# EAGLE schematic flight-computer v6 (EAGLE 9.7.0)

## Sheet 1 of 4
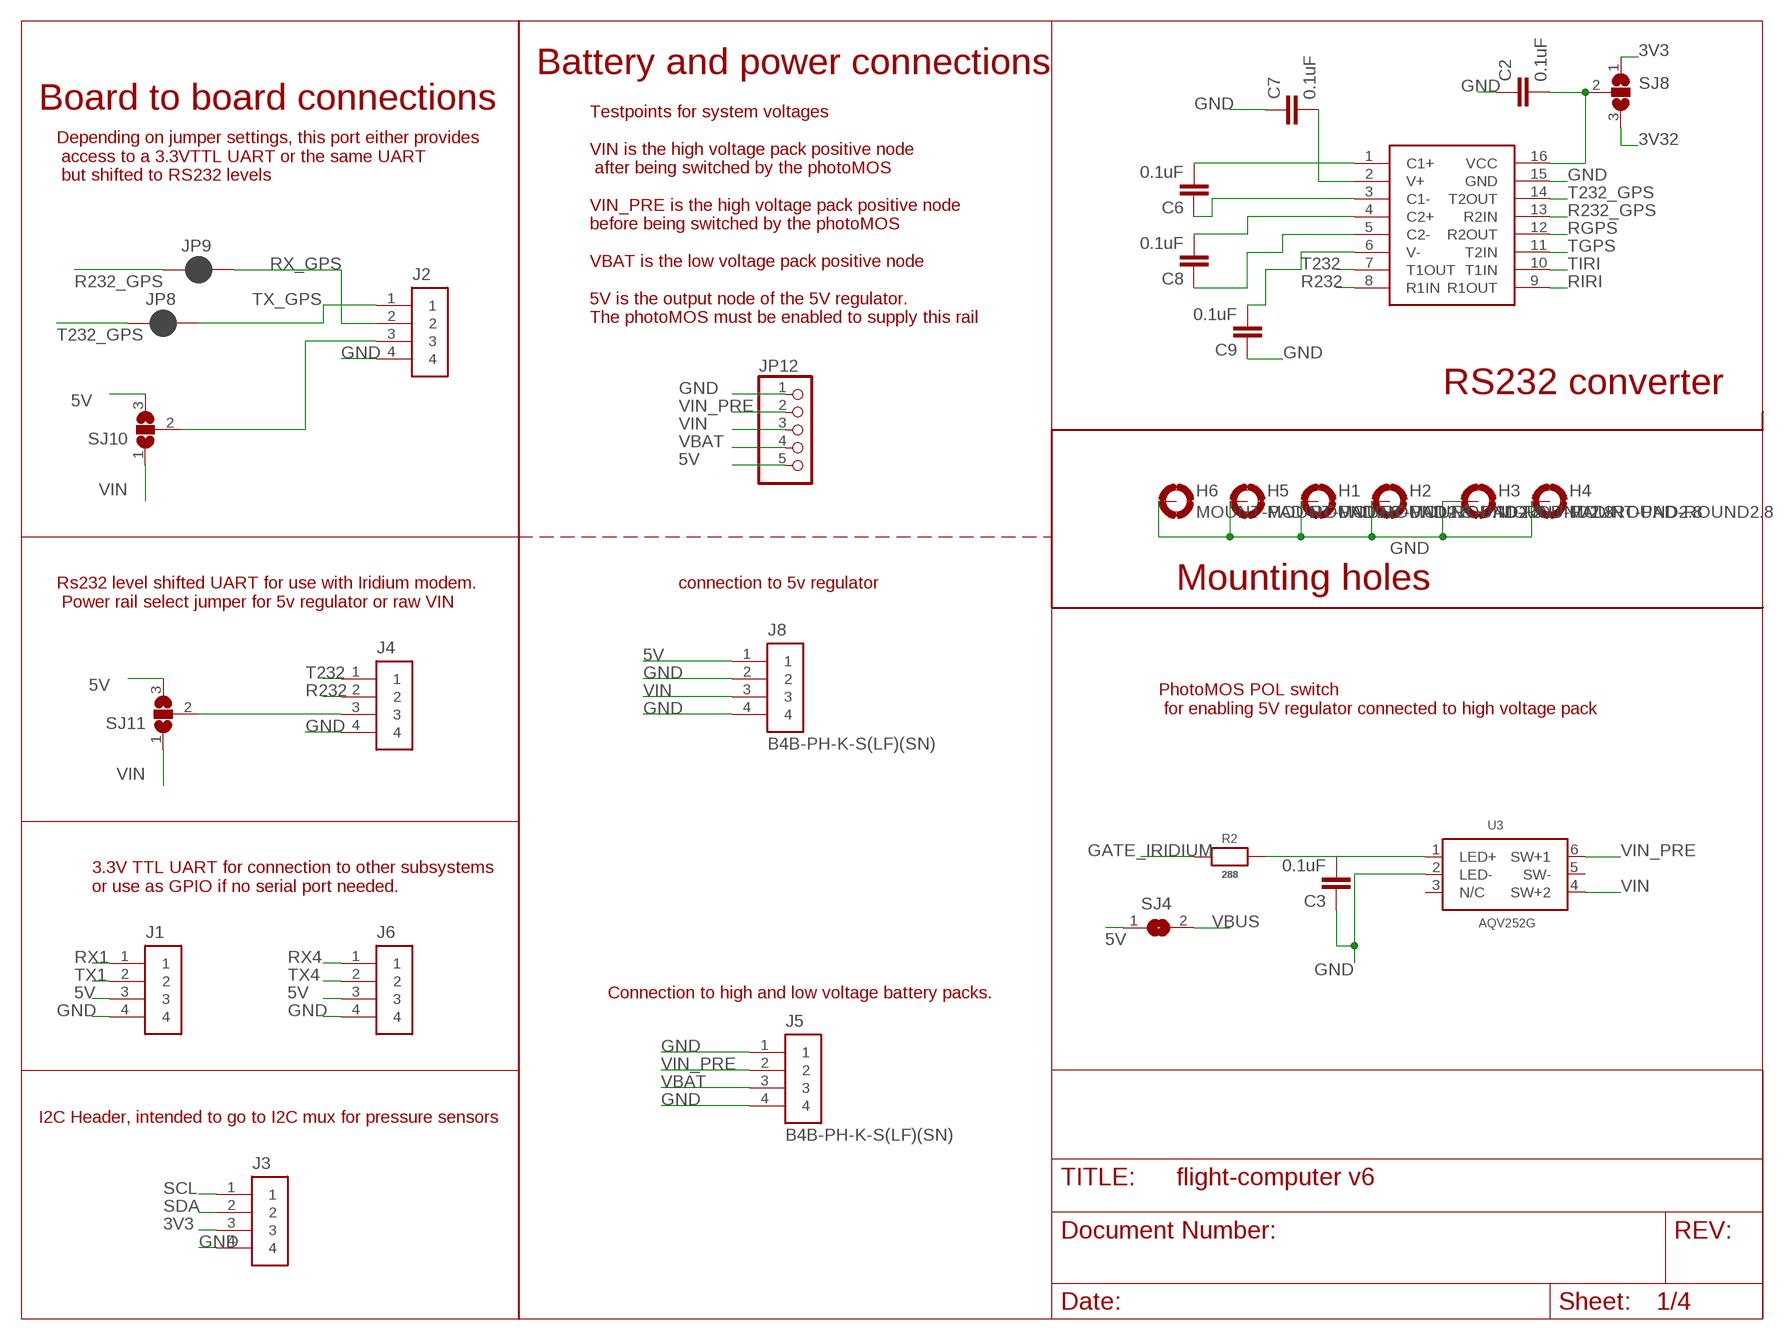
[diagram p0: schematic, sheet 1]

### Parts
C2  0.1uF  C-EUC0603  [C0603]
C3  0.1uF  C-EUC0603  [C0603]
C6  0.1uF  C-EUC0603  [C0603]
C7  0.1uF  C-EUC0603  [C0603]
C8  0.1uF  C-EUC0603  [C0603]
C9  0.1uF  C-EUC0603  [C0603]
H1  MOUNT-PAD-ROUND2.8  [2,8-PAD]
H2  MOUNT-PAD-ROUND2.8  [2,8-PAD]
H3  MOUNT-PAD-ROUND2.8  [2,8-PAD]
H4  MOUNT-PAD-ROUND2.8  [2,8-PAD]
H5  MOUNT-PAD-ROUND2.8  [2,8-PAD]
H6  MOUNT-PAD-ROUND2.8  [2,8-PAD]
J1  B4B-PH-K-S(LF)(SN)  [JST_B4B-PH-K-S(LF)(SN)]
J2  B4B-PH-K-S(LF)(SN)  [JST_B4B-PH-K-S(LF)(SN)]
J3  B4B-PH-K-S(LF)(SN)  [JST_B4B-PH-K-S(LF)(SN)]
J4  B4B-PH-K-S(LF)(SN)  [JST_B4B-PH-K-S(LF)(SN)]
J5  B4B-PH-K-S(LF)(SN)  [JST_B4B-PH-K-S(LF)(SN)]
J6  B4B-PH-K-S(LF)(SN)  [JST_B4B-PH-K-S(LF)(SN)]
J8  B4B-PH-K-S(LF)(SN)  [JST_B4B-PH-K-S(LF)(SN)]
JP8  JUMPER-SMT_2_NC_PASTE_SILK  [SMT-JUMPER_2_NC_PASTE_SILK]
JP9  JUMPER-SMT_2_NC_PASTE_SILK  [SMT-JUMPER_2_NC_PASTE_SILK]
JP12  PINHD-1X55X2MM  [1_05X2MM]
R2  288  RESISTOR_0603_NOOUT  [0603-NO]
SJ4  SJ  [SJ]
SJ8  SJ2W  [SJ_2]
SJ10  SJ2W  [SJ_2]
SJ11  SJ2W  [SJ_2]
U3  AQV252G  [SOP6]
U11  UM3232EEAE  [RQ_16_ADI]

### Nets
3V3: J3.3 SJ8.1 ; also sheet 2,3,4
3V32: SJ8.3 ; also sheet 2
5V: J1.3 J6.3 J8.1 JP12.5 SJ4.1 SJ10.3 SJ11.3 ; also sheet 2
GATE_IRIDIUM: R2.1 ; also sheet 2,4
GND [gnd]: C2.1 C3.1 C7.1 C9.1 H1.B2,8(MOUNT) H2.B2,8(MOUNT) H3.B2,8(MOUNT) H4.B2,8(MOUNT) H5.B2,8(MOUNT) H6.B2,8(MOUNT) J1.4 J2.4 J3.4 J4.4 J5.1 J5.4 J6.4 J8.2 J8.4 JP12.1 U3.2(LED-) U11.15(GND) ; also sheet 2,3,4
N$5: C6.2 U11.1(C1+)
N$6: J2.3 SJ10.2
N$9: C2.2 SJ8.2 U11.16(VCC)
N$11: C7.2 U11.2(V+)
N$12: C6.1 U11.3(C1-)
N$13: C8.2 U11.4(C2+)
N$14: C8.1 U11.5(C2-)
N$15: C9.2 U11.6(V-)
N$16: J4.3 SJ11.2
N$18: C3.2 R2.2 U3.1(LED+)
R232: J4.2 U11.8(R1IN)
R232_GPS: JP9.1 U11.13(R2IN)
RGPS: U11.12(R2OUT) ; also sheet 2
RIRI: U11.9(R1OUT) ; also sheet 2
RX1: J1.1 ; also sheet 2
RX4: J6.1 ; also sheet 2
RX_GPS: J2.2 JP9.2 ; also sheet 2
SCL: J3.1 ; also sheet 2,3,4
SDA: J3.2 ; also sheet 2,3,4
T232: J4.1 U11.7(T1OUT)
T232_GPS: JP8.1 U11.14(T2OUT)
TGPS: U11.11(T2IN) ; also sheet 2
TIRI: U11.10(T1IN) ; also sheet 2
TX1: J1.2 ; also sheet 2
TX4: J6.2 ; also sheet 2
TX_GPS: J2.1 JP8.2 ; also sheet 2
VBAT: J5.3 JP12.4 ; also sheet 2
VBUS: SJ4.2 ; also sheet 2
VIN: J8.3 JP12.3 SJ10.1 SJ11.1 U3.4(SW+2)
VIN_PRE: J5.2 JP12.2 U3.6(SW+1)
Unconnected: U3.3(N/C) U3.5(SW-)

### Notes on the sheet
- Battery and power connections
- Board to board connections
- Depending on jumper settings, this port either provides
   access to a 3.3VTTL UART or the same UART
   but shifted to RS232 levels
- Testpoints for system voltages
  
  VIN is the high voltage pack positive node
   after being switched by the photoMOS
  
  VIN_PRE is the high voltage pack positive node
  before being switched by the photoMOS
  
  VBAT is the low voltage pack positive node
  
  5V is the output node of the 5V regulator. 
  The photoMOS must be enabled to supply this rail
- RS232 converter
- Mounting holes
- Rs232 level shifted UART for use with Iridium modem.
   Power rail select jumper for 5v regulator or raw VIN
- connection to 5v regulator
- PhotoMOS POL switch
   for enabling 5V regulator connected to high voltage pack
- 3.3V TTL UART for connection to other subsystems
  or use as GPIO if no serial port needed.
- Connection to high and low voltage battery packs.
- I2C Header, intended to go to I2C mux for pressure sensors

## Sheet 2 of 4
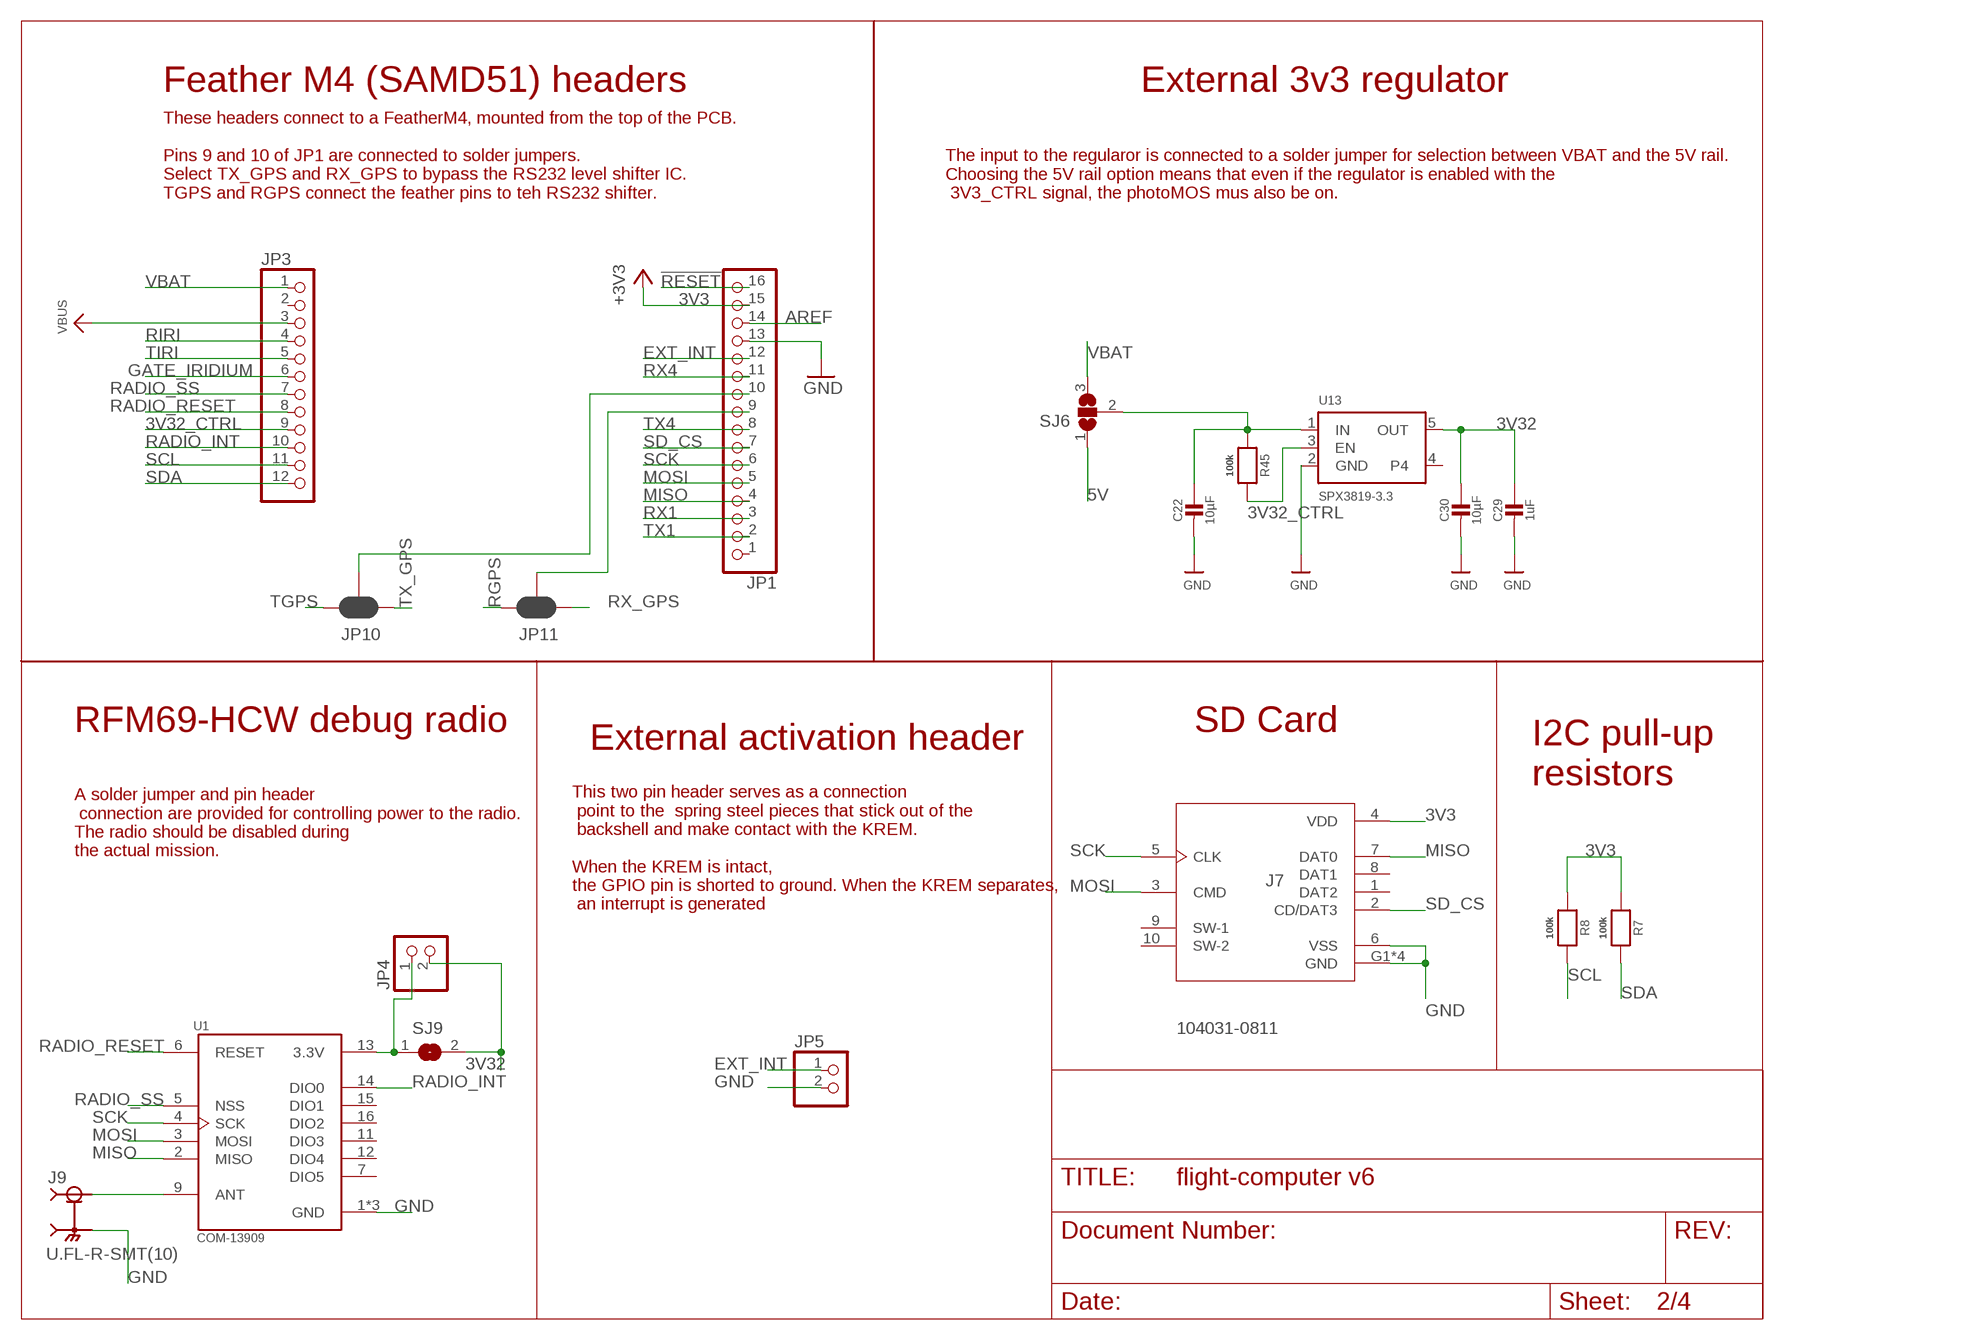
[diagram p1: schematic, sheet 2]

### Parts
C22  10µF  CAP_CERAMIC0805-NOOUTLINE  [0805-NO]
C29  1uF  CAP_CERAMIC0603_NO  [0603-NO]
C30  10µF  CAP_CERAMIC0805-NOOUTLINE  [0805-NO]
J7  104031-0811  [MOLEX_104031-0811]
J9  U.FL-R-SMT(10)  [HRS_U.FL-R-SMT(10)]
JP1  HEADER-1X16ROUND  [1X16_ROUND]
JP3  HEADER-1X12  [1X12_ROUND]
JP4  PINHD-1X2  [1X02]
JP5  PINHD-1X2  [1X02]
JP10  JUMPER-SMT_3_2-NC_PASTE_NO-SILK  [SMT-JUMPER_3_2-NC_PASTE_NO-SILK]
JP11  JUMPER-SMT_3_2-NC_PASTE_NO-SILK  [SMT-JUMPER_3_2-NC_PASTE_NO-SILK]
R7  100k  RESISTOR_0603_NOOUT  [0603-NO]
R8  100k  RESISTOR_0603_NOOUT  [0603-NO]
R45  100k  RESISTOR_0603_NOOUT  [0603-NO]
SJ6  SJ2W  [SJ_2]
SJ9  SJ  [SJ]
U1  COM-13909  [MOD_COM-13909]
U13  SPX3819-3.3  VREG_SOT23-5  [SOT23-5]

### Nets
3V3: J7.4(VDD) JP1.15 R7.1 R8.1 ; supply symbol labelled +3V3 ; also sheet 1,3,4
3V32: C29.1 C30.1 JP4.2 SJ9.2 U13.5(OUT) ; also sheet 1
3V32_CTRL: JP3.9 R45.2 U13.3(EN) ; also sheet 4
5V: SJ6.1 ; also sheet 1
!RESET: JP1.16
AREF: JP1.14
EXT_INT: JP1.12 JP5.1
GATE_IRIDIUM: JP3.6 ; also sheet 1,4
GND [gnd]: C22.2 C29.2 C30.2 J7.6(VSS) J7.G1(GND) J7.G2(GND) J7.G3(GND) J7.G4(GND) J9.2(GND) J9.3(GND) JP1.13 JP5.2 U1.1(GND) U1.8(GND) U1.10(GND) U13.2(GND) ; also sheet 1,3,4
MISO: J7.7(DAT0) JP1.4 U1.2(MISO)
MOSI: J7.3(CMD) JP1.5 U1.3(MOSI)
N$1: JP4.1 SJ9.1 U1.13(3.3V)
N$30: C22.1 R45.1 SJ6.2 U13.1(IN)
N$31: J9.1(SIG) U1.9(ANT)
N$38: JP1.10 JP10.2
N$39: JP1.9 JP11.2
RADIO_INT: JP3.10 U1.14(DIO0)
RADIO_RESET: JP3.8 U1.6(RESET)
RADIO_SS: JP3.7 U1.5(NSS)
RGPS: JP11.3 ; also sheet 1
RIRI: JP3.4 ; also sheet 1
RX1: JP1.3 ; also sheet 1
RX4: JP1.11 ; also sheet 1
RX_GPS: JP11.1 ; also sheet 1
SCK: J7.5(CLK) JP1.6 U1.4(SCK)
SCL: JP3.11 R8.2 ; also sheet 1,3,4
SD_CS: J7.2(CD/DAT3) JP1.7
SDA: JP3.12 R7.2 ; also sheet 1,3,4
TGPS: JP10.3 ; also sheet 1
TIRI: JP3.5 ; also sheet 1
TX1: JP1.2 ; also sheet 1
TX4: JP1.8 ; also sheet 1
TX_GPS: JP10.1 ; also sheet 1
VBAT: JP3.1 SJ6.3 ; also sheet 1
VBUS: JP3.3 ; also sheet 1
Unconnected: J7.1(DAT2) J7.8(DAT1) J7.9(SW-1) J7.10(SW-2) JP1.1 JP3.2 U1.7(DIO5) U1.11(DIO3) U1.12(DIO4) U1.15(DIO1) U1.16(DIO2) U13.4

### Notes on the sheet
- Feather M4 (SAMD51) headers | External 3v3 regulator
- These headers connect to a FeatherM4, mounted from the top of the PCB.
  
  Pins 9 and 10 of JP1 are connected to solder jumpers. 
  Select TX_GPS and RX_GPS to bypass the RS232 level shifter IC.
  TGPS and RGPS connect the feather pins to teh RS232 shifter.
- The input to the regularor is connected to a solder jumper for selection between VBAT and the 5V rail. 
  Choosing the 5V rail option means that even if the regulator is enabled with the
   3V3_CTRL signal, the photoMOS mus also be on.
- RFM69-HCW debug radio | SD Card
- External activation header
- I2C pull-up 
  resistors
- A solder jumper and pin header
   connection are provided for controlling power to the radio.
  The radio should be disabled during 
  the actual mission.
- This two pin header serves as a connection
   point to the  spring steel pieces that stick out of the
   backshell and make contact with the KREM.
  
  When the KREM is intact, 
  the GPIO pin is shorted to ground. When the KREM separates,
   an interrupt is generated

## Sheet 3 of 4
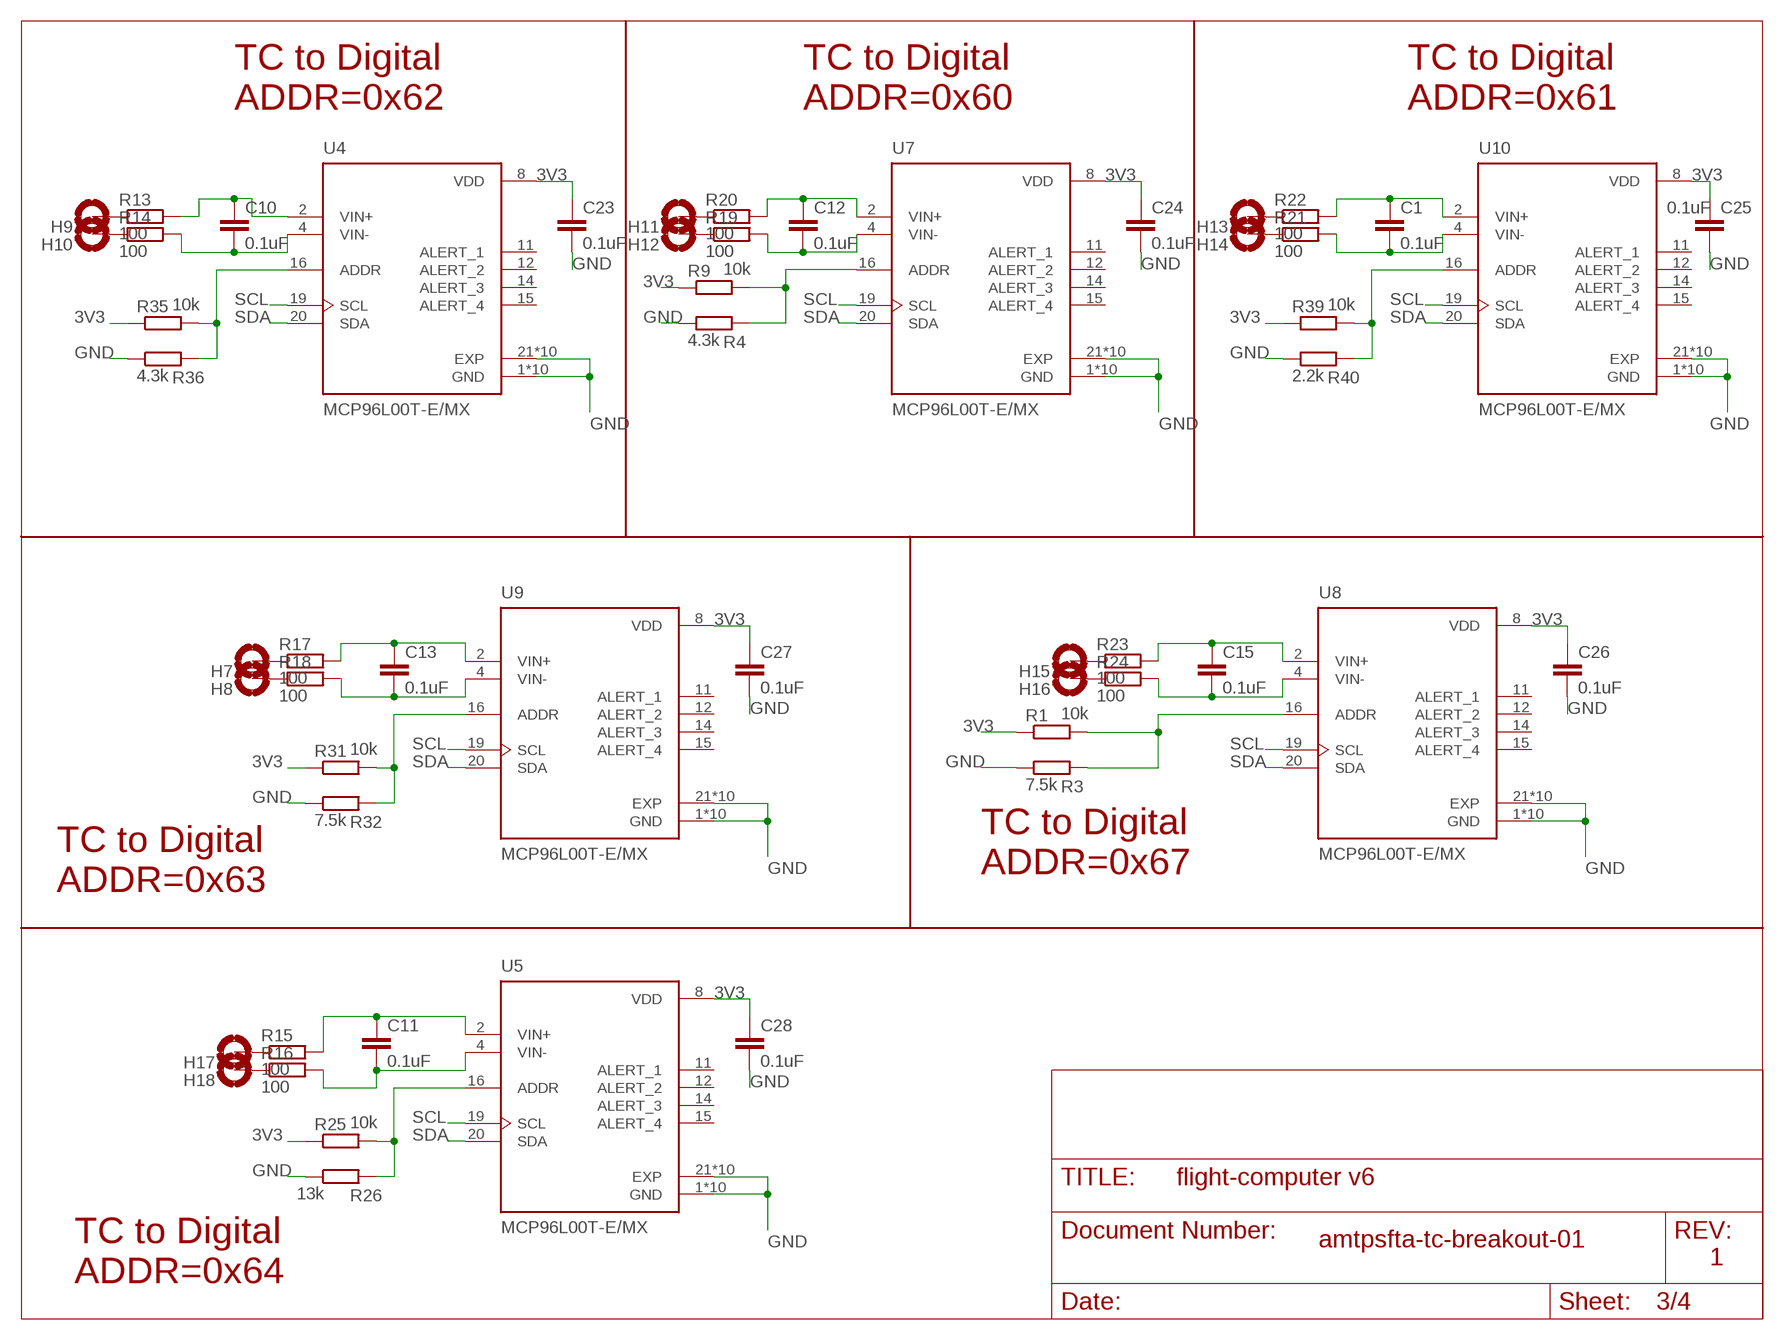
[diagram p2: schematic, sheet 3]

### Parts
C1  0.1uF  C-EUC0603  [C0603]
C10  0.1uF  C-EUC0603  [C0603]
C11  0.1uF  C-EUC0603  [C0603]
C12  0.1uF  C-EUC0603  [C0603]
C13  0.1uF  C-EUC0603  [C0603]
C15  0.1uF  C-EUC0603  [C0603]
C23  0.1uF  C-EUC0603  [C0603]
C24  0.1uF  C-EUC0603  [C0603]
C25  0.1uF  C-EUC0603  [C0603]
C26  0.1uF  C-EUC0603  [C0603]
C27  0.1uF  C-EUC0603  [C0603]
C28  0.1uF  C-EUC0603  [C0603]
H7  MOUNT-PAD-ROUND2.8  [2,8-PAD]
H8  MOUNT-PAD-ROUND2.8  [2,8-PAD]
H9  MOUNT-PAD-ROUND2.8  [2,8-PAD]
H10  MOUNT-PAD-ROUND2.8  [2,8-PAD]
H11  MOUNT-PAD-ROUND2.8  [2,8-PAD]
H12  MOUNT-PAD-ROUND2.8  [2,8-PAD]
H13  MOUNT-PAD-ROUND2.8  [2,8-PAD]
H14  MOUNT-PAD-ROUND2.8  [2,8-PAD]
H15  MOUNT-PAD-ROUND2.8  [2,8-PAD]
H16  MOUNT-PAD-ROUND2.8  [2,8-PAD]
H17  MOUNT-PAD-ROUND2.8  [2,8-PAD]
H18  MOUNT-PAD-ROUND2.8  [2,8-PAD]
R1  10k  R-EU_R0603  [R0603]
R3  7.5k  R-EU_R0603  [R0603]
R4  4.3k  R-EU_R0603  [R0603]
R9  10k  R-EU_R0603  [R0603]
R13  100  R-EU_R0603  [R0603]
R14  100  R-EU_R0603  [R0603]
R15  100  R-EU_R0603  [R0603]
R16  100  R-EU_R0603  [R0603]
R17  100  R-EU_R0603  [R0603]
R18  100  R-EU_R0603  [R0603]
R19  100  R-EU_R0603  [R0603]
R20  100  R-EU_R0603  [R0603]
R21  100  R-EU_R0603  [R0603]
R22  100  R-EU_R0603  [R0603]
R23  100  R-EU_R0603  [R0603]
R24  100  R-EU_R0603  [R0603]
R25  10k  R-EU_R0603  [R0603]
R26  13k  R-EU_R0603  [R0603]
R31  10k  R-EU_R0603  [R0603]
R32  7.5k  R-EU_R0603  [R0603]
R35  10k  R-EU_R0603  [R0603]
R36  4.3k  R-EU_R0603  [R0603]
R39  10k  R-EU_R0603  [R0603]
R40  2.2k  R-EU_R0603  [R0603]
U4  MCP96L00T-E/MX  [QFN65P500X500X100-21N_MCP96L00T-E/MX]
U5  MCP96L00T-E/MX  [QFN65P500X500X100-21N_MCP96L00T-E/MX]
U7  MCP96L00T-E/MX  [QFN65P500X500X100-21N_MCP96L00T-E/MX]
U8  MCP96L00T-E/MX  [QFN65P500X500X100-21N_MCP96L00T-E/MX]
U9  MCP96L00T-E/MX  [QFN65P500X500X100-21N_MCP96L00T-E/MX]
U10  MCP96L00T-E/MX  [QFN65P500X500X100-21N_MCP96L00T-E/MX]

### Nets
3V3: C23.1 C24.1 C25.1 C26.1 C27.1 C28.1 R1.1 R9.1 R25.1 R31.1 R35.1 R39.1 U4.8(VDD) U5.8(VDD) U7.8(VDD) U8.8(VDD) U9.8(VDD) U10.8(VDD) ; also sheet 1,2,4
GND [gnd]: C23.2 C24.2 C25.2 C26.2 C27.2 C28.2 R3.1 R4.1 R26.1 R32.1 R36.1 R40.1 U4.1(GND) U4.3(GND) U4.5(GND) U4.6(GND) U4.7(GND) U4.9(GND) U4.10(GND) U4.13(GND) U4.17(GND) U4.18(GND) U4.21(EXP) U4.22(EXP) U4.23(EXP) U4.24(EXP) U4.25(EXP) U4.26(EXP) U4.27(EXP) U4.28(EXP) U4.29(EXP) U4.30(EXP) U5.1(GND) U5.3(GND) U5.5(GND) U5.6(GND) U5.7(GND) U5.9(GND) U5.10(GND) U5.13(GND) U5.17(GND) U5.18(GND) U5.21(EXP) U5.22(EXP) U5.23(EXP) U5.24(EXP) U5.25(EXP) U5.26(EXP) U5.27(EXP) U5.28(EXP) U5.29(EXP) U5.30(EXP) U7.1(GND) U7.3(GND) U7.5(GND) U7.6(GND) U7.7(GND) U7.9(GND) U7.10(GND) U7.13(GND) U7.17(GND) U7.18(GND) U7.21(EXP) U7.22(EXP) U7.23(EXP) U7.24(EXP) U7.25(EXP) U7.26(EXP) U7.27(EXP) U7.28(EXP) U7.29(EXP) U7.30(EXP) U8.1(GND) U8.3(GND) U8.5(GND) U8.6(GND) U8.7(GND) U8.9(GND) U8.10(GND) U8.13(GND) U8.17(GND) U8.18(GND) U8.21(EXP) U8.22(EXP) U8.23(EXP) U8.24(EXP) U8.25(EXP) U8.26(EXP) U8.27(EXP) U8.28(EXP) U8.29(EXP) U8.30(EXP) U9.1(GND) U9.3(GND) U9.5(GND) U9.6(GND) U9.7(GND) U9.9(GND) U9.10(GND) U9.13(GND) U9.17(GND) U9.18(GND) U9.21(EXP) U9.22(EXP) U9.23(EXP) U9.24(EXP) U9.25(EXP) U9.26(EXP) U9.27(EXP) U9.28(EXP) U9.29(EXP) U9.30(EXP) U10.1(GND) U10.3(GND) U10.5(GND) U10.6(GND) U10.7(GND) U10.9(GND) U10.10(GND) U10.13(GND) U10.17(GND) U10.18(GND) U10.21(EXP) U10.22(EXP) U10.23(EXP) U10.24(EXP) U10.25(EXP) U10.26(EXP) U10.27(EXP) U10.28(EXP) U10.29(EXP) U10.30(EXP) ; also sheet 1,2,4
N$2: H7.B2,8(MOUNT) R17.1
N$8: H8.B2,8(MOUNT) R18.1
N$10: R1.2 R3.2 U8.16(ADDR)
N$17: R4.2 R9.2 U7.16(ADDR)
N$20: H9.B2,8(MOUNT) R13.1
N$21: H10.B2,8(MOUNT) R14.1
N$22: H11.B2,8(MOUNT) R20.1
N$23: H12.B2,8(MOUNT) R19.1
N$24: H13.B2,8(MOUNT) R22.1
N$25: H14.B2,8(MOUNT) R21.1
N$26: H15.B2,8(MOUNT) R23.1
N$27: H16.B2,8(MOUNT) R24.1
N$28: H17.B2,8(MOUNT) R15.1
N$29: H18.B2,8(MOUNT) R16.1
N$32: C10.1 R13.2 U4.2(VIN+)
N$34: C10.2 R14.2 U4.4(VIN-)
N$45: C12.1 R20.2 U7.2(VIN+)
N$46: C12.2 R19.2 U7.4(VIN-)
N$47: C15.1 R23.2 U8.2(VIN+)
N$48: C1.2 R21.2 U10.4(VIN-)
N$49: C15.2 R24.2 U8.4(VIN-)
N$50: C1.1 R22.2 U10.2(VIN+)
N$51: C13.1 R17.2 U9.2(VIN+)
N$53: C13.2 R18.2 U9.4(VIN-)
N$54: C11.1 R15.2 U5.2(VIN+)
N$55: C11.2 R16.2 U5.4(VIN-)
N$57: R25.2 R26.2 U5.16(ADDR)
N$58: R31.2 R32.2 U9.16(ADDR)
N$60: R35.2 R36.2 U4.16(ADDR)
N$62: R39.2 R40.2 U10.16(ADDR)
SCL: U4.19(SCL) U5.19(SCL) U7.19(SCL) U8.19(SCL) U9.19(SCL) U10.19(SCL) ; also sheet 1,2,4
SDA: U4.20(SDA) U5.20(SDA) U7.20(SDA) U8.20(SDA) U9.20(SDA) U10.20(SDA) ; also sheet 1,2,4
Unconnected: U4.11(ALERT_1) U4.12(ALERT_2) U4.14(ALERT_3) U4.15(ALERT_4) U5.11(ALERT_1) U5.12(ALERT_2) U5.14(ALERT_3) U5.15(ALERT_4) U7.11(ALERT_1) U7.12(ALERT_2) U7.14(ALERT_3) U7.15(ALERT_4) U8.11(ALERT_1) U8.12(ALERT_2) U8.14(ALERT_3) U8.15(ALERT_4) U9.11(ALERT_1) U9.12(ALERT_2) U9.14(ALERT_3) U9.15(ALERT_4) U10.11(ALERT_1) U10.12(ALERT_2) U10.14(ALERT_3) U10.15(ALERT_4)

### Notes on the sheet
- TC to Digital
  ADDR=0x62
- TC to Digital
  ADDR=0x60
- TC to Digital
  ADDR=0x61
- TC to Digital
  ADDR=0x67
- TC to Digital
  ADDR=0x63
- amtpsfta-tc-breakout-01
- 1
- TC to Digital
  ADDR=0x64

## Sheet 4 of 4
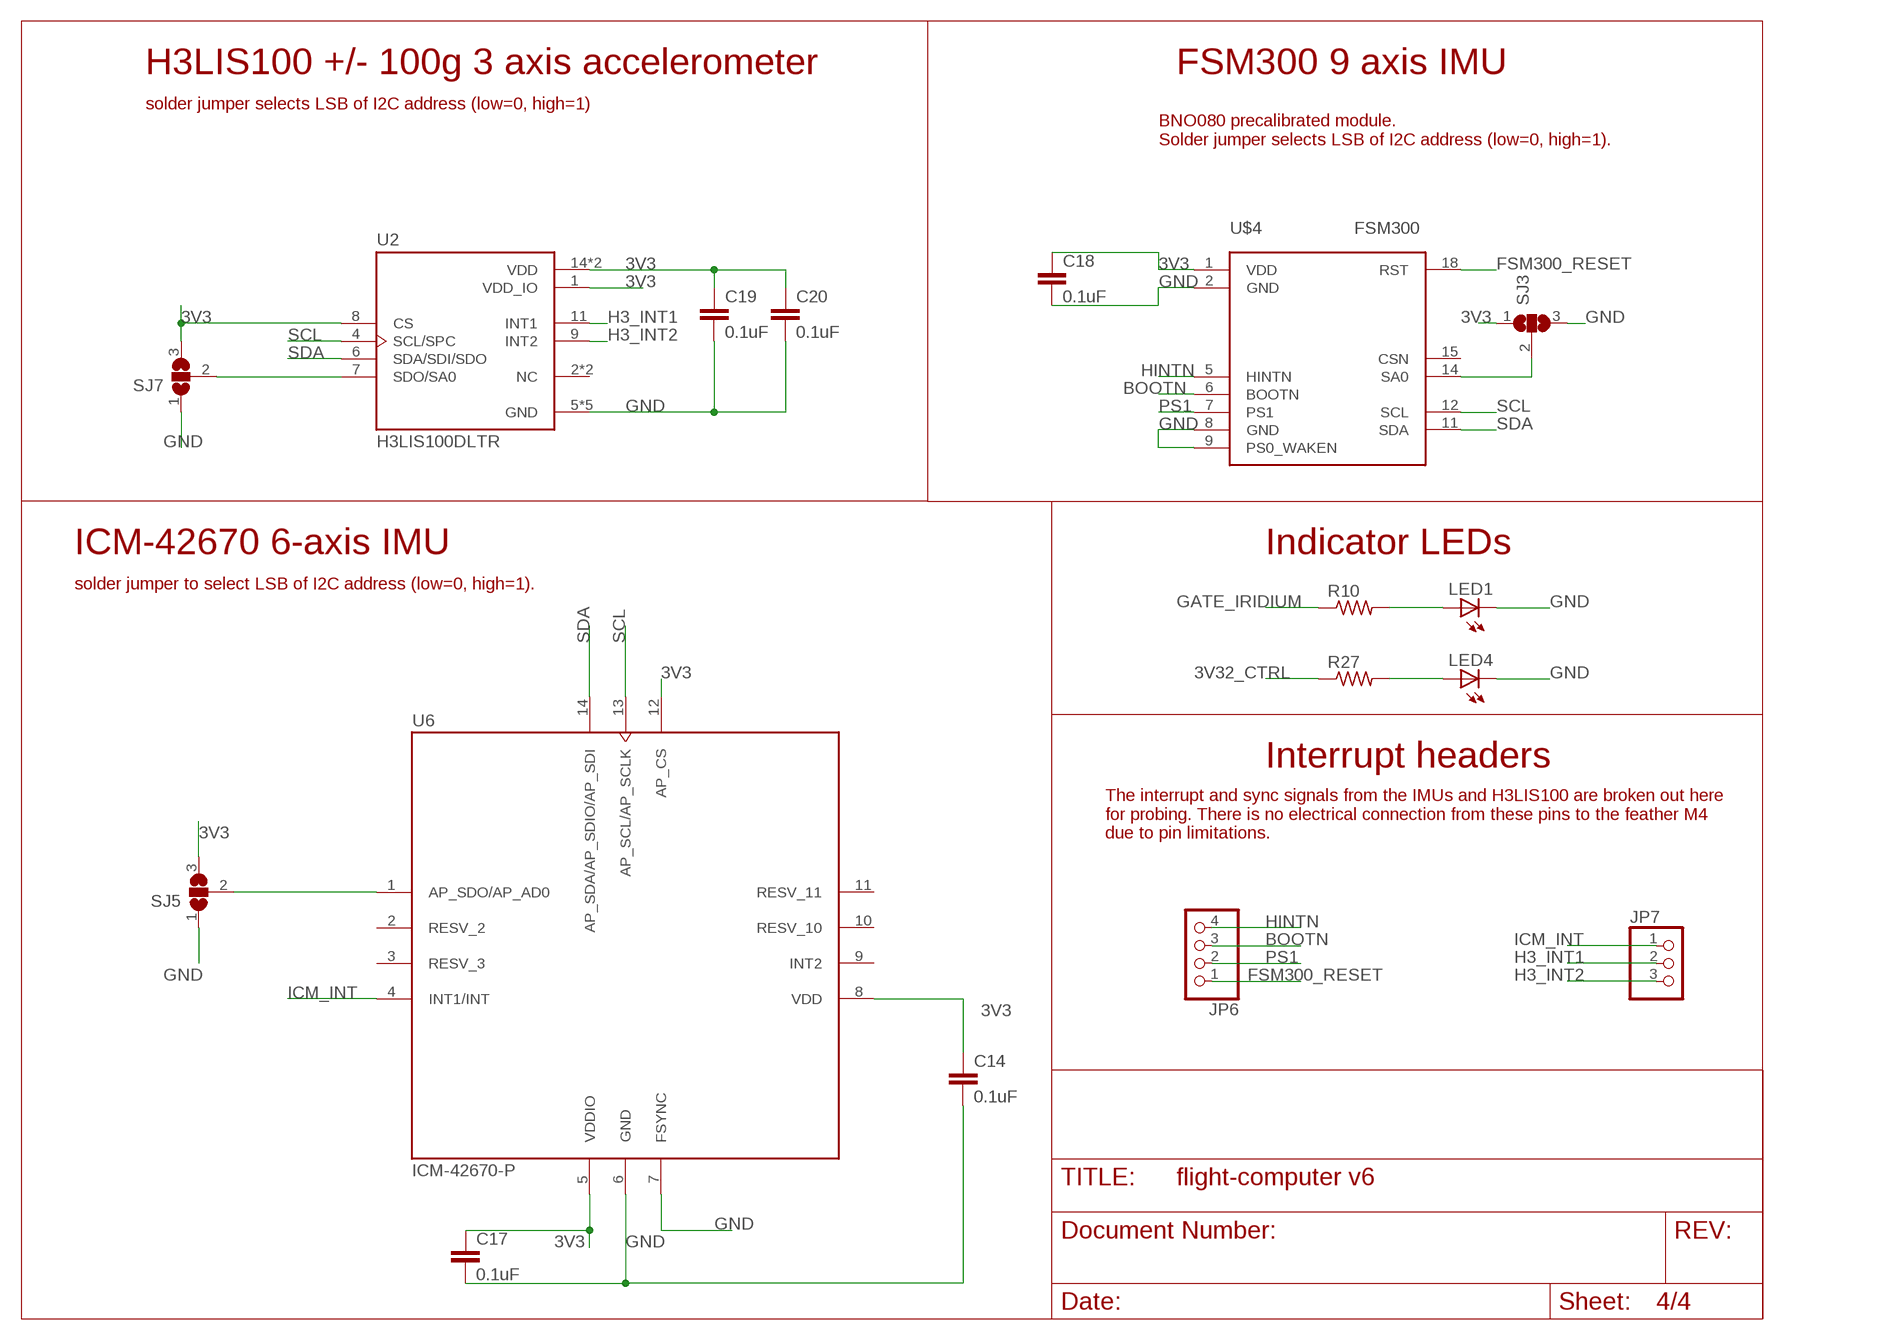
[diagram p3: schematic, sheet 4]

### Parts
C14  0.1uF  C-EUC0603  [C0603]
C17  0.1uF  C-EUC0603  [C0603]
C18  0.1uF  C-EUC0603  [C0603]
C19  0.1uF  C-EUC0603  [C0603]
C20  0.1uF  C-EUC0603  [C0603]
JP6  PINHD-1X4  [1X04]
JP7  PINHD-1X3  [1X03]
LED1  LEDCHIPLED_0603  [CHIPLED_0603]
LED4  LEDCHIPLED_0603  [CHIPLED_0603]
R10  R-US_R0603  [R0603]
R27  R-US_R0603  [R0603]
SJ3  SJ2W  [SJ_2]
SJ5  SJ2W  [SJ_2]
SJ7  SJ2W  [SJ_2]
U2  H3LIS100DLTR  [PQFN50P300X300X100-16N]
U6  ICM-42670-P  [IC_ICM-42670-P]
U$4  FSM300  [FSM300_FOOTPRINT]

### Nets
3V3: C14.1 C17.1 C18.1 C19.1 C20.1 SJ3.1 SJ5.3 SJ7.3 U2.1(VDD_IO) U2.8(CS) U2.14(VDD) U2.15(VDD) U6.5(VDDIO) U6.8(VDD) U6.12(AP_CS) U$4.1(VDD) ; also sheet 1,2,3
3V32_CTRL: R27.1 ; also sheet 2
BOOTN: JP6.3 U$4.6(BOOTN)
FSM300_RESET: JP6.1 U$4.18(RST)
GATE_IRIDIUM: R10.1 ; also sheet 1,2
GND [gnd]: C14.2 C17.2 C18.2 C19.2 C20.2 LED1.C LED4.C SJ3.3 SJ5.1 SJ7.1 U2.5(GND) U2.10(GND) U2.12(GND) U2.13(GND) U2.16(GND) U6.6(GND) U6.7(FSYNC) U$4.2(GND) U$4.8(GND) U$4.9(PS0_WAKEN) ; also sheet 1,2,3
H3_INT1: JP7.2 U2.11(INT1)
H3_INT2: JP7.3 U2.9(INT2)
HINTN: JP6.4 U$4.5(HINTN)
ICM_INT: JP7.1 U6.4(INT1/INT)
N$7: SJ5.2 U6.1(AP_SDO/AP_AD0)
N$19: LED1.A R10.2
N$35: SJ7.2 U2.7(SDO/SA0)
N$37: LED4.A R27.2
N$44: SJ3.2 U$4.14(SA0)
PS1: JP6.2 U$4.7(PS1)
SCL: U2.4(SCL/SPC) U6.13(AP_SCL/AP_SCLK) U$4.12(SCL) ; also sheet 1,2,3
SDA: U2.6(SDA/SDI/SDO) U6.14(AP_SDA/AP_SDIO/AP_SDI) U$4.11(SDA) ; also sheet 1,2,3
Unconnected: U2.2(NC) U2.3(NC) U6.2(RESV_2) U6.3(RESV_3) U6.9(INT2) U6.10(RESV_10) U6.11(RESV_11) U$4.15(CSN)

### Notes on the sheet
- H3LIS100 +/- 100g 3 axis accelerometer | FSM300 9 axis IMU
- solder jumper selects LSB of I2C address (low=0, high=1)
- BNO080 precalibrated module.
  Solder jumper selects LSB of I2C address (low=0, high=1).
- ICM-42670 6-axis IMU | Indicator LEDs
- solder jumper to select LSB of I2C address (low=0, high=1).
- Interrupt headers
- The interrupt and sync signals from the IMUs and H3LIS100 are broken out here
  for probing. There is no electrical connection from these pins to the feather M4
  due to pin limitations.

## Library data of the parts
C1-C3 C6-C15 C17-C20 C23-C28 = rcl:C-EU: CAPACITOR, European symbol; SPICEPREFIX: C
C22 C29 C30 = microbuilder:CAP_CERAMIC: Ceramic Capacitors For new designs, use the packages preceded by an '_' character since they are more reliable: The following footprints should be used on most boards: _0402 - Standard footprint for regular board layouts _0603 - Standard footprint for regular board layouts _0805 - Standard footprint for regular board layouts _1206 - Standard footprint for regular board layouts For extremely tight-pitch boards where space is at a premium, the following 'micro-pitch' footprints can be used (smaller pads, no silkscreen outline, etc.): _0402MP - Micro-pitch footprint for very dense/compact boards _0603MP - Micro-pitch footprint for very dense/compact boards _0805MP - Micro-pitch footprint for very dense/compact boards _1206MP - Micro-pitch footprint for very dense/compact boards
H1-H18 = holes:MOUNT-PAD-ROUND: MOUNTING PAD, round
J1-J6 J8 = B4B-PH-K-S_LF__SN_:B4B-PH-K-S(LF)(SN): PH Series 4 Position 2 mm Pitch Through Hole Crimp Top Entry Shrouded Header; DESCRIPTION: Connector Header Through Hole 4 position 0.079 (2.00mm); DIGI-KEY_PART_NUMBER: 455-1706-ND; MF: JST; MP: B4B-PH-K-S(LF)(SN); PACKAGE: None; PURCHASE-URL: https://pricing.snapeda.com/search/part/B4B-PH-K-S(LF)(SN)/?ref=eda
J7 = 104031-0811:104031-0811: 10 (8 + 2) Position Card Connector Secure Digital - microSD™ Surface Mount, Right Angle Gold; DESCRIPTION: 10 (8 + 2) Position Card Connector Secure Digital - microSD™ Surface Mount, Right Angle Gold; DIGI-KEY_PART_NUMBER: WM6357TR-ND; MF: Molex; MP: 104031-0811; PACKAGE: None; PURCHASE-URL: https://pricing.snapeda.com/search/part/104031-0811/?ref=eda
J9 = U.FL-R-SMT_10_:U.FL-R-SMT(10): U.FL Series 50 Ohm Receptacle Male Pins Ultra Small SMT Coaxial Connector; DESCRIPTION: U.FL (UMCC) Connector Receptacle, Male Pin 50Ohm Surface Mount Solder; DIGI-KEY_PART_NUMBER: H9161TR-ND; MF: Hirose Electric Co Ltd; MP: U.FL-R-SMT(10); PACKAGE: None; PURCHASE-URL: https://pricing.snapeda.com/search/part/U.FL-R-SMT(10)/?ref=eda
JP1 = microbuilder:HEADER-1X16: PIN HEADER
JP3 = microbuilder:HEADER-1X12
JP4 JP5 = pinhead:PINHD-1X2: PIN HEADER
JP6 = pinhead:PINHD-1X4: PIN HEADER
JP7 = pinhead:PINHD-1X3: PIN HEADER
JP8 JP9 = SparkFun-Jumpers:JUMPER-SMT_2_NC_PASTE: Normally closed solder jumper This jumper has an aperture in the stencil to allow solder paste to bridge the split in the wire so it's normally closed (NC). Wick off the solder to open the connection. Reapply solder to reclose the connection.
JP10 JP11 = SparkFun-Jumpers:JUMPER-SMT_3_2-NC_PASTE: Normally closed solder jumper (2 of 2 connections) This jumper has an aperture in the stencil to allow solder paste to bridge both connections. Both connections are normally closed (NC). Wick off the solder to open the connection(s). Reapply solder to reclose the connection(s).
JP12 = Connector:PINHD-1X5: PIN HEADER; CATEGORY: CONNECTOR; SUB-CATEGORY: PIN-HEADER
LED1 LED4 = adafruit:LED: LED OSRAM: - CHIPLED LG R971, LG N971, LY N971, LG Q971, LY Q971, LO R971, LY R971 LH N974, LH R974 LS Q976, LO Q976, LY Q976 LO Q996 - Hyper CHIPLED LW Q18S LB Q993, LB Q99A, LB R99A - SideLED LS A670, LO A670, LY A670, LG A670, LP A670 LB A673, LV A673, LT A673, LW A673 LH A674 LY A675 LS A676, LA A676, LO A676, LY A676, LW A676 LS A679, LY A679, LG A679 - Hyper Micro SIDELED® LS Y876, LA Y876, LO Y876, LY Y876 LT Y87S - SmartLED LW L88C, LW L88S LB L89C, LB L89S, LG L890 LS L89K, LO L89K, LY L89K LS L896, LA L896, LO L896, LY L896 - TOPLED LS T670, LO T670, LY T670, LG T670, LP T670 LSG T670, LSP T670, LSY T670, LOP T670, LYG T670 LG T671, LOG T671, LSG T671 LB T673, LV T673, LT T673, LW T673 LH T674 LS T676, LA T676, LO T676, LY T676, LB T676, LH T676, LSB T676, LW T676 LB T67C, LV T67C, LT T67C, LS T67K, LO T67K, LY T67K, LW E67C LS E67B, LA E67B, LO E67B, LY E67B, LB E67C, LV E67C, LT E67C LW T67C LS T679, LY T679, LG T679 LS T770, LO T770, LY T770, LG T770, LP T770 LB T773, LV T773, LT T773, LW T773 LH T774 LS E675, LA E675, LY E675, LS T675 LS T776, LA T776, LO T776, LY T776, LB T776 LHGB T686 LT T68C, LB T68C - Hyper Mini TOPLED® LB M676 - Mini TOPLED Santana® LG M470 LS M47K, LO M47K, LY M47K Source: http://www.osram.convergy.de/
R1 R3 R4 R9 R13-R26 R31 R32 R35 R36 R39 R40 = rcl:R-EU_: RESISTOR, European symbol; SPICEPREFIX: R
R2 R7 R8 R45 = microbuilder:RESISTOR: Resistors For new designs, use the packages preceded by an '_' character since they are more reliable: The following footprints should be used on most boards: _0402 - Standard footprint for regular board layouts _0603 - Standard footprint for regular board layouts _0805 - Standard footprint for regular board layouts _1206 - Standard footprint for regular board layouts For extremely tight-pitch boards where space is at a premium, the following 'micro-pitch' footprints can be used (smaller pads, no silkscreen outline, etc.): _0402MP - Micro-pitch footprint for very dense/compact boards _0603MP - Micro-pitch footprint for very dense/compact boards _0805MP - Micro-pitch footprint for very dense/compact boards _1206MP - Micro-pitch footprint for very dense/compact boards
R10 R27 = rcl:R-US_: RESISTOR, American symbol; SPICEPREFIX: R
SJ3 SJ5-SJ8 SJ10 SJ11 = jumper:SJ2W: SMD solder JUMPER
SJ4 SJ9 = jumper:SJ: SMD solder JUMPER
U1 = COM-13909:COM-13909: Rfm69hcw Wireless Transceiver 91; DESCRIPTION: General ISM < 1GHz Transceiver Module 915MHz Surface Mount; DIGI-KEY_PART_NUMBER: 1568-1394-ND; DIGI-KEY_PURCHASE_URL: https://www.digikey.com/product-detail/en/sparkfun-electronics/COM-13909/1568-1394-ND/6023504?utm_source=snapeda&utm_medium=aggregator&utm_campaign=symbol; MF: SparkFun Electronics; MP: COM-13909; PACKAGE: Module SparkFun Electronics
U2 = H3LIS100DLTR:H3LIS100DLTR: Accelerometer X, Y, Z Axis ±100g 25Hz ~ 200Hz 16-TFLGA (3x3); DESCRIPTION: Accelerometer X, Y, Z Axis ±100g 25Hz ~ 200Hz 16-TFLGA (3x3); DIGI-KEY_PART_NUMBER: 497-15697-2-ND; MF: STMicroelectronics; MP: H3LIS100DLTR; PACKAGE: TFLGA-16 STMicroelectronics; PURCHASE-URL: https://pricing.snapeda.com/search/part/H3LIS100DLTR/?ref=eda
U3 = AQV252G:AQV252G; DESCRIPTION: Solid State SPST-NO (1 Form A) 6-SMD (0.300, 7.62mm); DIGI-KEY_PART_NUMBER: 255-1791-5-ND; MF: Panasonic; MP: AQV252G; PACKAGE: None; PURCHASE-URL: https://pricing.snapeda.com/search/part/AQV252G/?ref=eda
U4 U5 U7-U10 = MCP96L00T-E_MX:MCP96L00T-E/MX: MCP9600 Series Thermocouple Electromotive Force to ±1.5°C Converter - VQFN-2; DESCRIPTION: +/- 4.0C THERMOCOUPLE TO I2C CON; DIGI-KEY_PART_NUMBER: MCP96L00T-E/MXCT-ND; MF: Microchip Technology; MP: MCP96L00T-E/MX; PACKAGE: VQFN-20 Microchip; PURCHASE-URL: https://pricing.snapeda.com/search/part/MCP96L00T-E/MX/?ref=eda
U6 = ICM-42670-P:ICM-42670-P; DESCRIPTION: Low-Power, Premium Performance 6-Axis MotionTrackingTM IMU with I3C, I2C and SPI interface in 2.5mm x 3mm Package; DIGI-KEY_PART_NUMBER: 1428-ICM-42670-PTR-ND; MF: TDK InvenSense; MP: ICM-42670-P; PACKAGE: None; PURCHASE-URL: https://pricing.snapeda.com/search/part/ICM-42670-P/?ref=eda
U11 = ADM310:UM3232EEAE
U13 = microbuilder:VREG_SOT23-5: SOT23-5 Fixed Voltage Regulators Part Current Out V Out V In V Dropout θJA (°C/W) TJ (°C) Digikey Part No. ADP121 150mA 3.3V 3.4-5.5V 0.09V @ 150mA -- -- ADP121-AUJZ33R7CT-ND ADP121 150mA 3.0V 3.1-5.5V 0.09V @ 150mA -- -- ADP121-AUJZ30R7CT-ND ADP122 300mA 3.3V 3.4-5.5V 0.085V @ 300mA -- -- ADP122AUJZ-3.3-R7CT-ND ADP1712 300mA 3.3V 3.5-5.5V 0.17V @ 300mA -- -- ADP1712AUJZ-3.3-R7TR-ND AP7311 (Low Cost) 150mA 3.3V 3.5-6V 0.15V @ 150mA -- -- AP7311-33WG-7DICT-ND LD39015M18R 150mA 1.8V 1.9V-5.5V 0.08V @ 100mA -- -- 497-6977-1-ND LP2985A-33DBVR 150mA 3.3V 3.3-16V 0.28V @ 150mA 206 150 296-18479-1-ND MCP1824T-3302E/OT 300mA 3.3V 3.5V-6V 0.2V @ 300mA -- -- MCP1824T-3302E/OTCT-ND MIC5205-2.5YM5 TR 150mA 2.5V 2.7-16V 0.165V @ 150mA -- -- 576-1257-2-ND MIC5205-3.0YM5 TR 150mA 3.0V 3.2V-16V 0.165V @ 150mA -- -- 576-1258-2-ND MIC5205-3.3YM5 TR 150mA 3.3V 3.5V-16V 0.165V @ 150mA -- -- 576-1259-2-ND TPS780330220 150mA 3.3V+2.2V 3.6-5.5V 250mV Max -- -- 296-23332-1-ND TDA3663/N1,135 100mA 3.3V 3.5-45V 0.18V @ 50mA -- -- 568-5343-1-ND Max operating temp can be calculated using θJA, TJ (max junction temperature), and power in watts. Set the "Maximum Ambient Temperature" until it reaches TJ ("Max Junction Temperature"), which is the absolute limit for safe use of the regulator: Heat Sink Temperature Calculator <http://www.daycounter.com/Calculators/Heat-Sink-Temperature-Calculator.phtml> For example, With 12V source into a 3.3V LP2985 and a 30mA load, we are dissipating (12V-3.3V) * 0.03A = 0.261W. With a θJA of 206 °C/W, a TJ of 150°C, and 261mW we can safely use the chip without a heat sink up to 75°C (=147.1°C Junction Temperature).
U$4 = COM-13909:FSM300

## Net classes
1 power: width 0.305 mm
2 gnd: width 0.254 mm